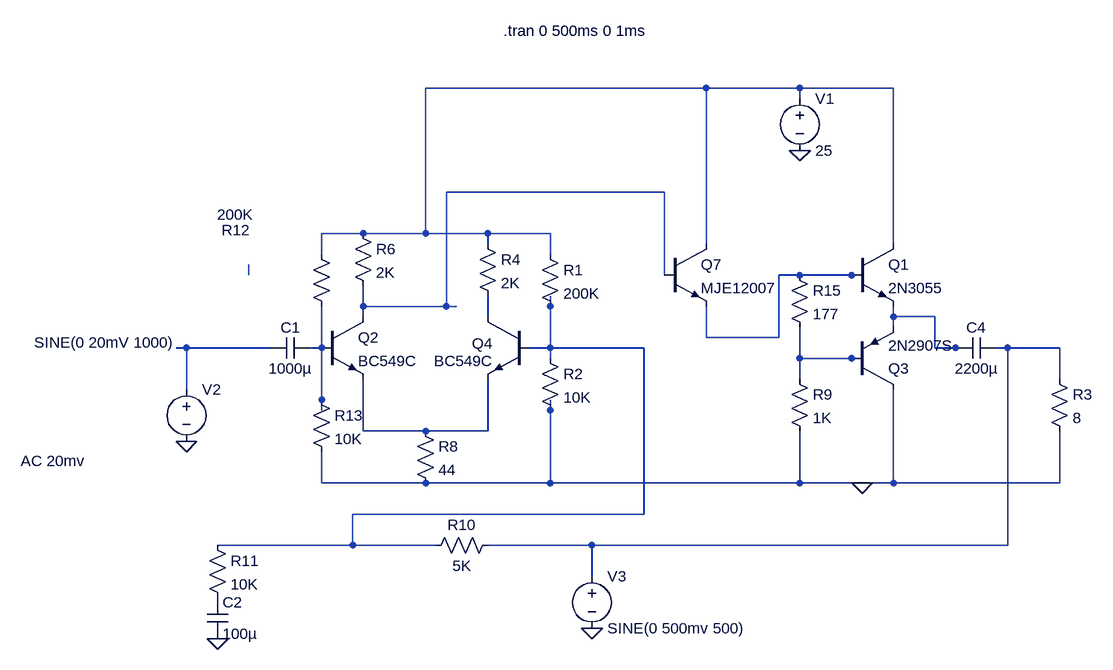
[diagram p0: schematic Long tailed with BC549 and MJE3055.asc]
Long tailed with BC549 and MJE3055.asc, the LTspice schematic file:
Version 4
SHEET 1 1032 680
WIRE -5040 -3440 -5472 -3440
WIRE -4896 -3440 -5040 -3440
WIRE -4752 -3440 -4896 -3440
WIRE -4896 -3424 -4896 -3440
WIRE -5104 -3280 -5440 -3280
WIRE -5568 -3216 -5632 -3216
WIRE -5472 -3216 -5472 -3440
WIRE -5472 -3216 -5568 -3216
WIRE -5376 -3216 -5472 -3216
WIRE -5280 -3216 -5376 -3216
WIRE -5376 -3200 -5376 -3216
WIRE -5040 -3200 -5040 -3440
WIRE -4752 -3200 -4752 -3440
WIRE -5632 -3184 -5632 -3216
WIRE -5280 -3184 -5280 -3216
WIRE -5744 -3152 -5744 -3168
WIRE -5104 -3152 -5104 -3280
WIRE -4896 -3152 -4928 -3152
WIRE -4816 -3152 -4896 -3152
WIRE -4800 -3152 -4816 -3152
WIRE -5568 -3104 -5568 -3136
WIRE -5440 -3104 -5440 -3280
WIRE -5440 -3104 -5568 -3104
WIRE -5424 -3104 -5440 -3104
WIRE -5280 -3104 -5280 -3120
WIRE -5568 -3088 -5568 -3104
WIRE -5376 -3088 -5376 -3120
WIRE -4752 -3088 -4752 -3104
WIRE -4688 -3088 -4752 -3088
WIRE -4752 -3072 -4752 -3088
WIRE -5040 -3056 -5040 -3104
WIRE -4928 -3056 -4928 -3152
WIRE -4928 -3056 -5040 -3056
WIRE -5840 -3040 -5856 -3040
WIRE -5712 -3040 -5840 -3040
WIRE -5632 -3040 -5632 -3104
WIRE -5632 -3040 -5648 -3040
WIRE -5280 -3040 -5280 -3104
WIRE -5280 -3040 -5312 -3040
WIRE -5136 -3040 -5280 -3040
WIRE -4688 -3040 -4688 -3088
WIRE -4656 -3040 -4688 -3040
WIRE -4640 -3040 -4656 -3040
WIRE -4576 -3040 -4592 -3040
WIRE -4496 -3040 -4576 -3040
WIRE -5280 -3024 -5280 -3040
WIRE -4896 -3024 -4896 -3072
WIRE -4816 -3024 -4896 -3024
WIRE -4800 -3024 -4816 -3024
WIRE -4896 -2992 -4896 -3024
WIRE -4496 -2992 -4496 -3040
WIRE -5840 -2976 -5840 -3040
WIRE -5632 -2960 -5632 -3040
WIRE -5632 -2944 -5632 -2960
WIRE -5280 -2944 -5280 -2960
WIRE -5568 -2912 -5568 -2992
WIRE -5472 -2912 -5568 -2912
WIRE -5376 -2912 -5376 -2992
WIRE -5376 -2912 -5472 -2912
WIRE -5632 -2832 -5632 -2880
WIRE -5472 -2832 -5632 -2832
WIRE -5280 -2832 -5280 -2944
WIRE -5280 -2832 -5472 -2832
WIRE -4896 -2832 -4896 -2912
WIRE -4896 -2832 -5280 -2832
WIRE -4800 -2832 -4896 -2832
WIRE -4752 -2832 -4752 -2976
WIRE -4752 -2832 -4800 -2832
WIRE -4496 -2832 -4496 -2912
WIRE -4496 -2832 -4752 -2832
WIRE -5136 -2784 -5136 -3040
WIRE -5136 -2784 -5584 -2784
WIRE -5584 -2736 -5584 -2784
WIRE -5584 -2736 -5792 -2736
WIRE -5456 -2736 -5584 -2736
WIRE -5216 -2736 -5376 -2736
WIRE -4576 -2736 -4576 -3040
WIRE -4576 -2736 -5216 -2736
WIRE -5216 -2688 -5216 -2736
FLAG -4896 -3344 0
FLAG -5840 -2896 0
FLAG -5792 -2592 0
FLAG -5216 -2608 0
FLAG -4800 -2832 0
SYMBOL voltage -4896 -3440 R0
WINDOW 123 0 0 Left 2
WINDOW 39 0 0 Left 2
SYMATTR InstName V1
SYMATTR Value 25
SYMBOL voltage -5840 -2992 R0
WINDOW 123 -255 126 Left 2
WINDOW 39 0 0 Left 2
WINDOW 3 -234 -56 Left 2
SYMATTR Value2 AC 20mv
SYMATTR Value SINE(0 20mV 1000)
SYMATTR InstName V2
SYMBOL cap -5648 -3056 R90
WINDOW 0 0 32 VBottom 2
WINDOW 3 32 32 VTop 2
SYMATTR InstName C1
SYMATTR Value 1000µ
SYMBOL npn -5632 -3088 R0
SYMATTR InstName Q2
SYMATTR Value BC549C
SYMBOL npn -5312 -3088 M0
WINDOW 0 56 41 Left 2
SYMATTR InstName Q4
SYMATTR Value BC549C
SYMBOL res -5584 -3232 R0
SYMATTR InstName R6
SYMATTR Value 2K
SYMBOL res -5488 -2928 R0
SYMATTR InstName R8
SYMATTR Value 44
SYMBOL res -5360 -2752 R90
WINDOW 0 0 56 VBottom 2
WINDOW 3 32 56 VTop 2
SYMATTR InstName R10
SYMATTR Value 5K
SYMBOL res -5808 -2752 R0
SYMATTR InstName R11
SYMATTR Value 10K
SYMBOL res -5648 -3200 R0
WINDOW 0 -138 -21 Left 2
WINDOW 3 -145 -45 Left 2
SYMATTR InstName R12
SYMATTR Value 200K
SYMBOL res -5648 -2976 R0
SYMATTR InstName R13
SYMATTR Value 10K
SYMBOL res -5296 -3200 R0
SYMATTR InstName R1
SYMATTR Value 200K
SYMBOL res -5296 -3040 R0
SYMATTR InstName R2
SYMATTR Value 10K
SYMBOL cap -5808 -2656 R0
SYMATTR InstName C2
SYMATTR Value 100µ
SYMBOL res -5392 -3216 R0
SYMATTR InstName R4
SYMATTR Value 2K
SYMBOL voltage -5216 -2704 R0
WINDOW 123 0 0 Left 2
WINDOW 39 0 0 Left 2
SYMATTR InstName V3
SYMATTR Value SINE(0 500mv 500)
SYMBOL npn2 -4816 -3200 R0
SYMATTR InstName Q1
SYMATTR Value 2N3055
SYMBOL res -4512 -3008 R0
SYMATTR InstName R3
SYMATTR Value 8
SYMBOL pnp -4816 -2976 M180
SYMATTR InstName Q3
SYMATTR Value 2N2907S
SYMBOL cap -4592 -3056 R90
WINDOW 0 0 32 VBottom 2
WINDOW 3 32 32 VTop 2
SYMATTR InstName C4
SYMATTR Value 2200µ
SYMBOL res -4912 -3008 R0
SYMATTR InstName R9
SYMATTR Value 1K
SYMBOL res -4912 -3168 R0
SYMATTR InstName R15
SYMATTR Value 177
SYMBOL npn -5104 -3200 R0
SYMATTR InstName Q7
SYMATTR Value MJE12007
TEXT -5352 -3528 Left 2 !.tran 0 500ms 0 1ms

The netlist it stands for:
* Long tailed with BC549 and MJE3055.asc
V1 N001 0 25
V2 N008 0 SINE(0 20mV 1000) AC 20mv
C1 N009 N008 1000µ
Q2 N002 N009 N012 0 BC549C
Q4 N006 N005 N012 0 BC549C
R6 N001 N002 2K
R8 N012 0 44
R10 N010 N005 5K
R11 N005 P001 10K
R12 N001 N009 200K
R13 N009 0 10K
R1 N001 N005 200K
R2 N005 0 10K
C2 P001 0 100µ
R4 N001 N006 2K
V3 N010 0 SINE(0 500mv 500)
Q1 N001 N004 N007 0 2N3055
R3 N010 0 8
Q3 0 N011 N007 0 2N2907S
C4 N010 N007 2200µ
R9 N011 0 1K
R15 N004 N011 177
Q7 N001 N002 N004 0 MJE12007
.model NPN NPN
.model PNP PNP
.lib standard.bjt
.tran 0 500ms 0 1ms
.backanno
.end